# Altium schematic sheet S7CAS-PLEIADES-CARTE-MERE_P06_DAC.SchDoc
size Tabloid; SheetNumber: 17; SheetTotal: 18; Sheet_Name: DAC; Size: 11x17
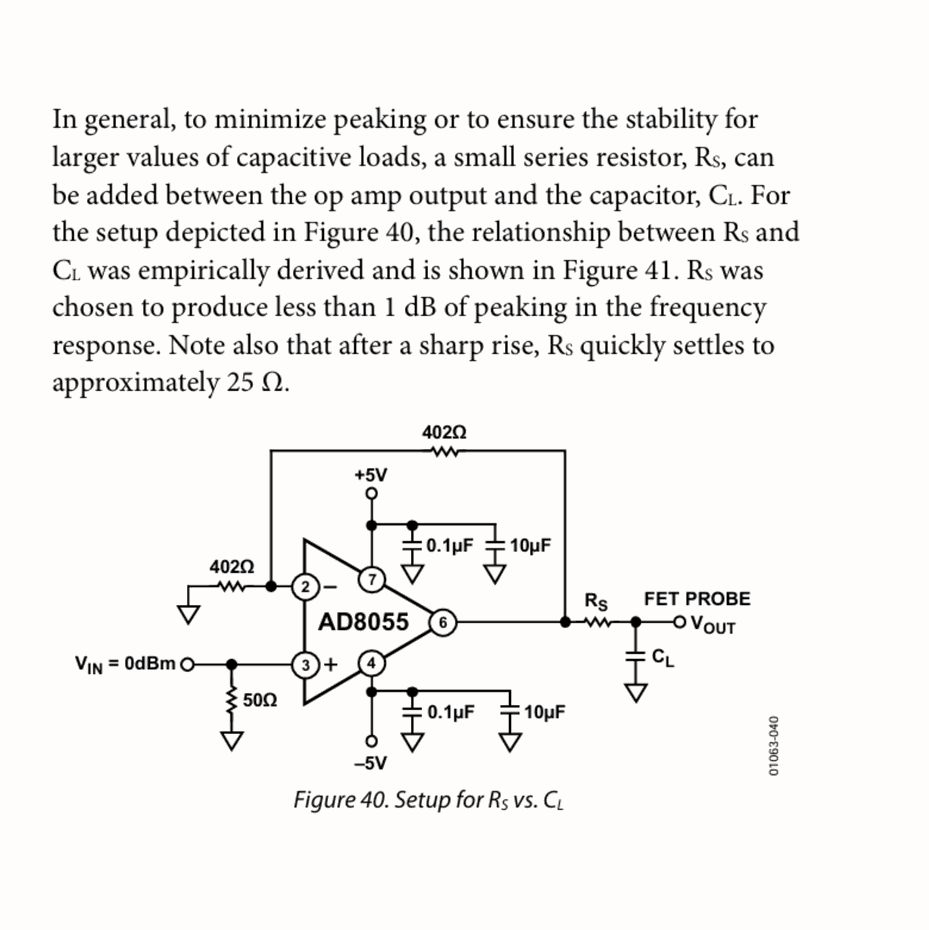
[diagram p0: S7CAS-PLEIADES-CARTE-MERE_P06_DAC.SchDoc, left]
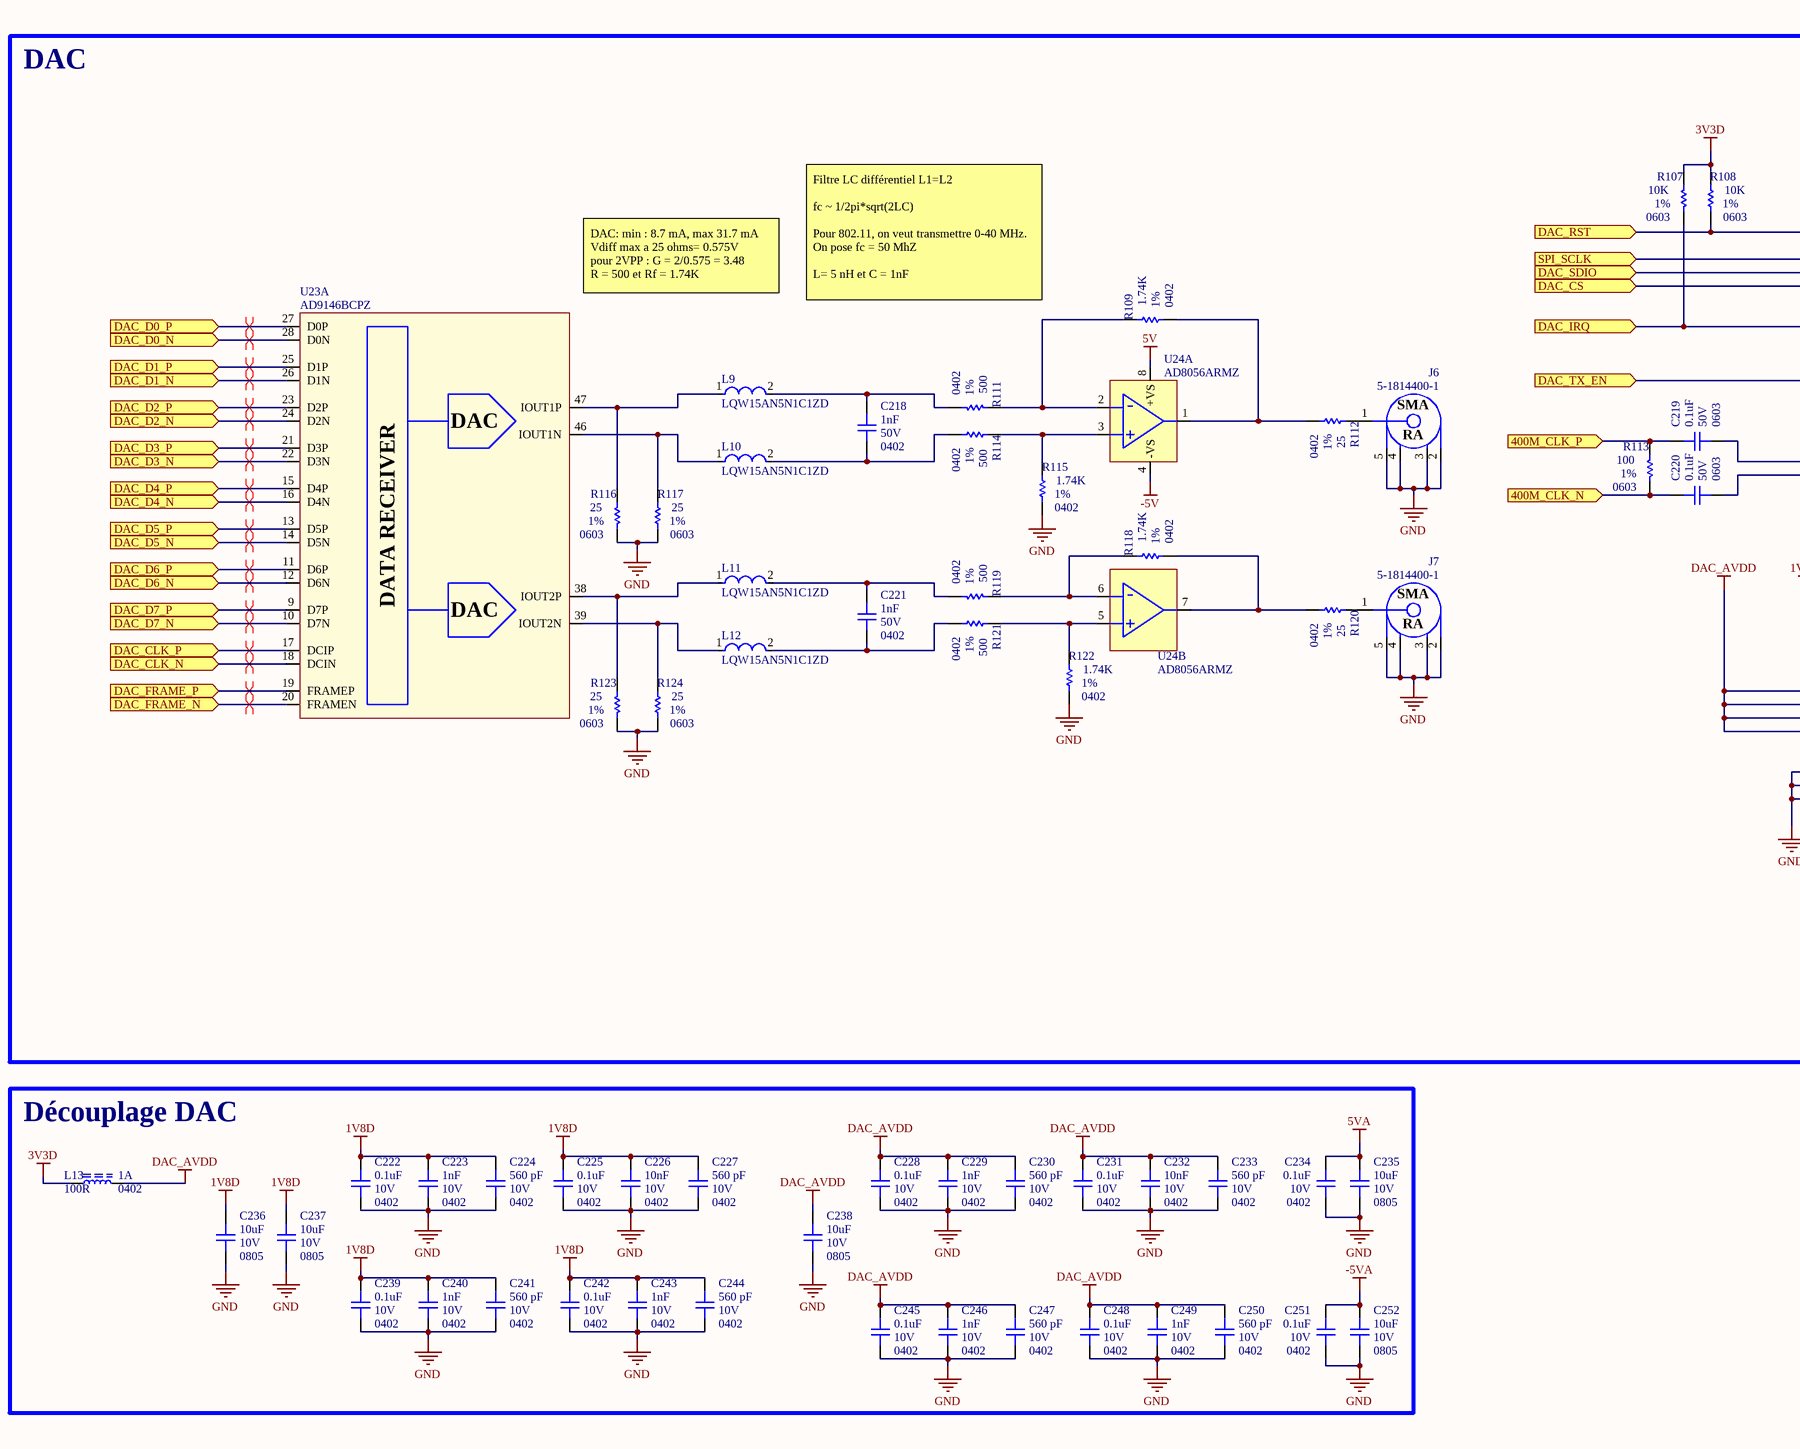
[diagram p1: S7CAS-PLEIADES-CARTE-MERE_P06_DAC.SchDoc, middle]
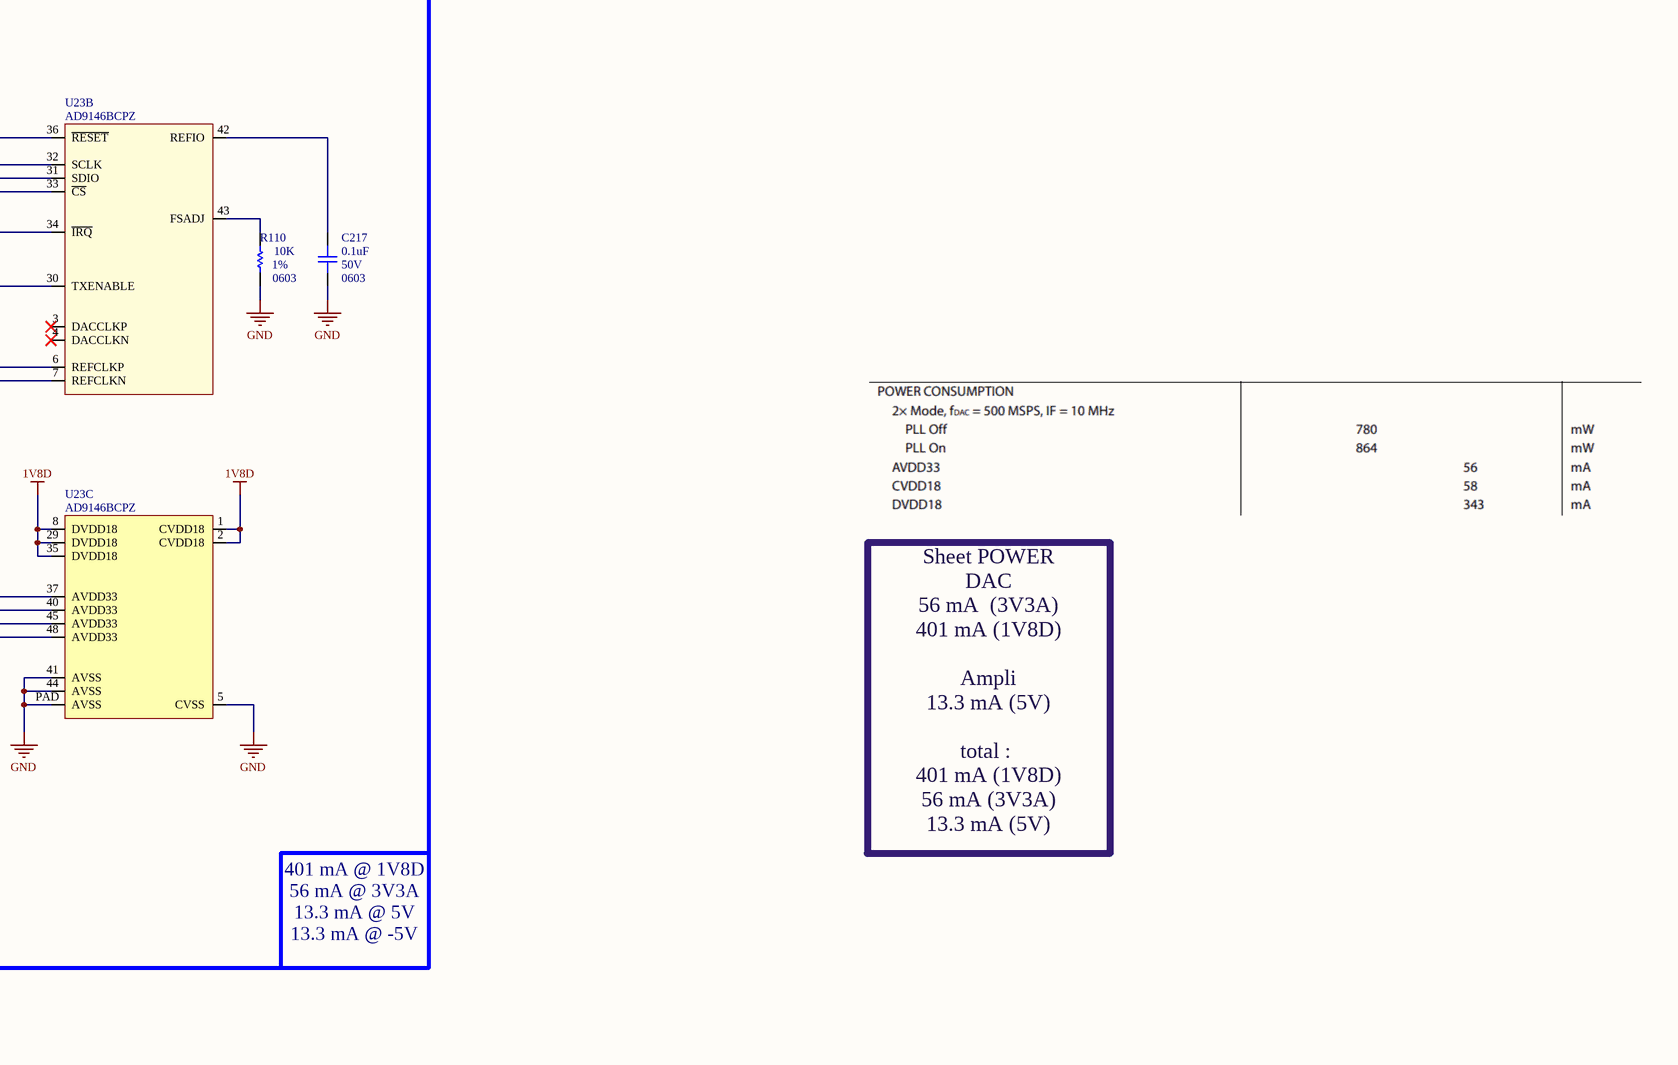
[diagram p2: S7CAS-PLEIADES-CARTE-MERE_P06_DAC.SchDoc, right]

## Parts
C217  value 0.1uF  Voltage: 50V  Package: 0603  [CAP_0603]  (hidden comment: CAP - 0603)
C218  value 1nF  Voltage: 50V  Package: 0402  [CAP_0402]  (hidden comment: CAP - 0402)
C219  value 0.1uF  Voltage: 50V  Package: 0603  [CAP_0603]  (hidden comment: CAP - 0603)
C220  value 0.1uF  Voltage: 50V  Package: 0603  [CAP_0603]  (hidden comment: CAP - 0603)
C221  value 1nF  Voltage: 50V  Package: 0402  [CAP_0402]  (hidden comment: CAP - 0402)
C222  value 0.1uF  Voltage: 10V  Package: 0402  [CAP_0402]  (hidden comment: CAP - 0402)
C223  value 1nF  Voltage: 10V  Package: 0402  [CAP_0402]  (hidden comment: CAP - 0402)
C224  value 560 pF  Voltage: 10V  Package: 0402  [CAP_0402]  (hidden comment: CAP - 0402)
C225  value 0.1uF  Voltage: 10V  Package: 0402  [CAP_0402]  (hidden comment: CAP - 0402)
C226  value 10nF  Voltage: 10V  Package: 0402  [CAP_0402]  (hidden comment: CAP - 0402)
C227  value 560 pF  Voltage: 10V  Package: 0402  [CAP_0402]  (hidden comment: CAP - 0402)
C228  value 0.1uF  Voltage: 10V  Package: 0402  [CAP_0402]  (hidden comment: CAP - 0402)
C229  value 1nF  Voltage: 10V  Package: 0402  [CAP_0402]  (hidden comment: CAP - 0402)
C230  value 560 pF  Voltage: 10V  Package: 0402  [CAP_0402]  (hidden comment: CAP - 0402)
C231  value 0.1uF  Voltage: 10V  Package: 0402  [CAP_0402]  (hidden comment: CAP - 0402)
C232  value 10nF  Voltage: 10V  Package: 0402  [CAP_0402]  (hidden comment: CAP - 0402)
C233  value 560 pF  Voltage: 10V  Package: 0402  [CAP_0402]  (hidden comment: CAP - 0402)
C234  value 0.1uF  Voltage: 10V  Package: 0402  [CAP_0402]  (hidden comment: CAP - 0402)
C235  value 10uF  Voltage: 10V  Package: 0805  [CAP_0805]  (hidden comment: CAP - 0805)
C236  value 10uF  Voltage: 10V  Package: 0805  [CAP_0805]  (hidden comment: CAP - 0805)
C237  value 10uF  Voltage: 10V  Package: 0805  [CAP_0805]  (hidden comment: CAP - 0805)
C238  value 10uF  Voltage: 10V  Package: 0805  [CAP_0805]  (hidden comment: CAP - 0805)
C239  value 0.1uF  Voltage: 10V  Package: 0402  [CAP_0402]  (hidden comment: CAP - 0402)
C240  value 1nF  Voltage: 10V  Package: 0402  [CAP_0402]  (hidden comment: CAP - 0402)
C241  value 560 pF  Voltage: 10V  Package: 0402  [CAP_0402]  (hidden comment: CAP - 0402)
C242  value 0.1uF  Voltage: 10V  Package: 0402  [CAP_0402]  (hidden comment: CAP - 0402)
C243  value 1nF  Voltage: 10V  Package: 0402  [CAP_0402]  (hidden comment: CAP - 0402)
C244  value 560 pF  Voltage: 10V  Package: 0402  [CAP_0402]  (hidden comment: CAP - 0402)
C245  value 0.1uF  Voltage: 10V  Package: 0402  [CAP_0402]  (hidden comment: CAP - 0402)
C246  value 1nF  Voltage: 10V  Package: 0402  [CAP_0402]  (hidden comment: CAP - 0402)
C247  value 560 pF  Voltage: 10V  Package: 0402  [CAP_0402]  (hidden comment: CAP - 0402)
C248  value 0.1uF  Voltage: 10V  Package: 0402  [CAP_0402]  (hidden comment: CAP - 0402)
C249  value 1nF  Voltage: 10V  Package: 0402  [CAP_0402]  (hidden comment: CAP - 0402)
C250  value 560 pF  Voltage: 10V  Package: 0402  [CAP_0402]  (hidden comment: CAP - 0402)
C251  value 0.1uF  Voltage: 10V  Package: 0402  [CAP_0402]  (hidden comment: CAP - 0402)
C252  value 10uF  Voltage: 10V  Package: 0805  [CAP_0805]  (hidden comment: CAP - 0805)
J6  5-1814400-1  [CONN_SMA_5-1814400-1]
J7  5-1814400-1  [CONN_SMA_5-1814400-1]
L9  LQW15AN5N1C1ZD  [FP-LQW15AN_00-W0_6-0_1-MFG]
L10  LQW15AN5N1C1ZD  [FP-LQW15AN_00-W0_6-0_1-MFG]
L11  LQW15AN5N1C1ZD  [FP-LQW15AN_00-W0_6-0_1-MFG]
L12  LQW15AN5N1C1ZD  [FP-LQW15AN_00-W0_6-0_1-MFG]
L13  value 100R  Current: 1A  Package: 0402  [FER_0402]  (hidden comment: FER - 0402)
R107  value 10K  Package: 0603  Precision: 1%  [RES_0603]  (hidden comment: RES - 0603)
R108  value 10K  Package: 0603  Precision: 1%  [RES_0603]  (hidden comment: RES - 0603)
R109  value 1.74K  Package: 0402  Precision: 1%  [RES_0402]  (hidden comment: RES - 0402)
R110  value 10K  Package: 0603  Precision: 1%  [RES_0603]  (hidden comment: RES - 0603)
R111  value 500  Package: 0402  Precision: 1%  [RES_0402]  (hidden comment: RES - 0402)
R112  value 25  Package: 0402  Precision: 1%  [RES_0402]  (hidden comment: RES - 0402)
R113  value 100  Package: 0603  Precision: 1%  [RES_0603]  (hidden comment: RES - 0603)
R114  value 500  Package: 0402  Precision: 1%  [RES_0402]  (hidden comment: RES - 0402)
R115  value 1.74K  Package: 0402  Precision: 1%  [RES_0402]  (hidden comment: RES - 0402)
R116  value 25  Package: 0603  Precision: 1%  [RES_0603]  (hidden comment: RES - 0603)
R117  value 25  Package: 0603  Precision: 1%  [RES_0603]  (hidden comment: RES - 0603)
R118  value 1.74K  Package: 0402  Precision: 1%  [RES_0402]  (hidden comment: RES - 0402)
R119  value 500  Package: 0402  Precision: 1%  [RES_0402]  (hidden comment: RES - 0402)
R120  value 25  Package: 0402  Precision: 1%  [RES_0402]  (hidden comment: RES - 0402)
R121  value 500  Package: 0402  Precision: 1%  [RES_0402]  (hidden comment: RES - 0402)
R122  value 1.74K  Package: 0402  Precision: 1%  [RES_0402]  (hidden comment: RES - 0402)
R123  value 25  Package: 0603  Precision: 1%  [RES_0603]  (hidden comment: RES - 0603)
R124  value 25  Package: 0603  Precision: 1%  [RES_0603]  (hidden comment: RES - 0603)
U23  AD9146BCPZ  [DAC_AD9146BCPZ]  (parts A,B,C of 3)
U24  AD8056ARMZ  [OPAMP_AD8056ARMZ]  (parts A,B of 2)

## Blocks framed on the sheet
DAC: C217-C221 J6 J7 L9-L12 R107-R124 U23 U24
Découplage DAC: C222-C252 L13

## Ports
400M_CLK_N (in, see S7CAS-PLEIADES-CARTE-MERE_P06_CLOCK[4B]), 400M_CLK_P (in, see S7CAS-PLEIADES-CARTE-MERE_P06_CLOCK[4A]), DAC_CLK_N (in, see S7CAS-PLEIADES-CARTE-MERE_P06_FPGA1[4B]), DAC_CLK_P (in, see S7CAS-PLEIADES-CARTE-MERE_P06_FPGA1[4B]), DAC_CS (in, see S7CAS-PLEIADES-CARTE-MERE_P06_FPGA3[6B]), DAC_D0_N (in, see S7CAS-PLEIADES-CARTE-MERE_P06_FPGA1[4A]), DAC_D0_P (in, see S7CAS-PLEIADES-CARTE-MERE_P06_FPGA1[4A]), DAC_D1_N (in, see S7CAS-PLEIADES-CARTE-MERE_P06_FPGA1[4A]), DAC_D1_P (in, see S7CAS-PLEIADES-CARTE-MERE_P06_FPGA1[4A]), DAC_D2_N (in, see S7CAS-PLEIADES-CARTE-MERE_P06_FPGA1[4A]), DAC_D2_P (in, see S7CAS-PLEIADES-CARTE-MERE_P06_FPGA1[4A]), DAC_D3_N (in, see S7CAS-PLEIADES-CARTE-MERE_P06_FPGA1[4A]), DAC_D3_P (in, see S7CAS-PLEIADES-CARTE-MERE_P06_FPGA1[4A]), DAC_D4_N (in, see S7CAS-PLEIADES-CARTE-MERE_P06_FPGA1[4A]), DAC_D4_P (in, see S7CAS-PLEIADES-CARTE-MERE_P06_FPGA1[4A]), DAC_D5_N (in, see S7CAS-PLEIADES-CARTE-MERE_P06_FPGA1[4A]), DAC_D5_P (in, see S7CAS-PLEIADES-CARTE-MERE_P06_FPGA1[4A]), DAC_D6_N (in, see S7CAS-PLEIADES-CARTE-MERE_P06_FPGA1[4B]), DAC_D6_P (in, see S7CAS-PLEIADES-CARTE-MERE_P06_FPGA1[4B]), DAC_D7_N (in, see S7CAS-PLEIADES-CARTE-MERE_P06_FPGA1[4B]), DAC_D7_P (in, see S7CAS-PLEIADES-CARTE-MERE_P06_FPGA1[4B]), DAC_FRAME_N (in, see S7CAS-PLEIADES-CARTE-MERE_P06_FPGA1[4B]), DAC_FRAME_P (in, see S7CAS-PLEIADES-CARTE-MERE_P06_FPGA1[4B]), DAC_IRQ (in, see S7CAS-PLEIADES-CARTE-MERE_P06_FPGA3[6B]), DAC_RST (in, see S7CAS-PLEIADES-CARTE-MERE_P06_FPGA3[6A]), DAC_SDIO (in, see S7CAS-PLEIADES-CARTE-MERE_P06_FPGA3[6B]), DAC_TX_EN (in, see S7CAS-PLEIADES-CARTE-MERE_P06_FPGA3[6B]), SPI_SCLK (in, see S7CAS-PLEIADES-CARTE-MERE_P06_FPGA3[6B])

## Nets
1V8D: C222.2 C223.2 C224.2 C225.2 C226.2 C227.2 C236.2 C237.2 C239.2 C240.2 C241.2 C242.2 C243.2 C244.2 U23.1(CVDD18) U23.2(CVDD18) U23.8(DVDD18) U23.29(DVDD18) U23.35(DVDD18)
3V3D: L13.2 R107.2 R108.2
5V: U24.8(+VS)
5VA: C234.2 C235.2
-5V: U24.4(-VS)
-5VA: C251.2 C252.2
DAC_AVDD: C228.2 C229.2 C230.2 C231.2 C232.2 C233.2 C238.2 C245.2 C246.2 C247.2 C248.2 C249.2 C250.2 L13.1 U23.37(AVDD33) U23.40(AVDD33) U23.45(AVDD33) U23.48(AVDD33)
GND: C217.1 C222.1 C223.1 C224.1 C225.1 C226.1 C227.1 C228.1 C229.1 C230.1 C231.1 C232.1 C233.1 C234.1 C235.1 C236.1 C237.1 C238.1 C239.1 C240.1 C241.1 C242.1 C243.1 C244.1 C245.1 C246.1 C247.1 C248.1 C249.1 C250.1 C251.1 C252.1 J6.2 J6.3 J6.4 J6.5 J7.2 J7.3 J7.4 J7.5 R110.1 R115.1 R116.1 R117.1 R122.1 R123.1 R124.1 U23.5(CVSS) U23.41(AVSS) U23.44(AVSS) U23.PAD(AVSS)
400M_CLK_N: C220.2 R113.1 ; port 400M_CLK_N
400M_CLK_P: C219.2 R113.2 ; port 400M_CLK_P
DAC_CLK_N: U23.18(DCIN) ; port DAC_CLK_N
DAC_CLK_P: U23.17(DCIP) ; port DAC_CLK_P
DAC_CS: U23.33(~{CS}) ; port DAC_CS
DAC_D0_N: U23.28(D0N) ; port DAC_D0_N
DAC_D0_P: U23.27(D0P) ; port DAC_D0_P
DAC_D1_N: U23.26(D1N) ; port DAC_D1_N
DAC_D1_P: U23.25(D1P) ; port DAC_D1_P
DAC_D2_N: U23.24(D2N) ; port DAC_D2_N
DAC_D2_P: U23.23(D2P) ; port DAC_D2_P
DAC_D3_N: U23.22(D3N) ; port DAC_D3_N
DAC_D3_P: U23.21(D3P) ; port DAC_D3_P
DAC_D4_N: U23.16(D4N) ; port DAC_D4_N
DAC_D4_P: U23.15(D4P) ; port DAC_D4_P
DAC_D5_N: U23.14(D5N) ; port DAC_D5_N
DAC_D5_P: U23.13(D5P) ; port DAC_D5_P
DAC_D6_N: U23.12(D6N) ; port DAC_D6_N
DAC_D6_P: U23.11(D6P) ; port DAC_D6_P
DAC_D7_N: U23.10(D7N) ; port DAC_D7_N
DAC_D7_P: U23.9(D7P) ; port DAC_D7_P
DAC_FRAME_N: U23.20(FRAMEN) ; port DAC_FRAME_N
DAC_FRAME_P: U23.19(FRAMEP) ; port DAC_FRAME_P
DAC_IRQ: R107.1 U23.34(~{IRQ}) ; port DAC_IRQ
DAC_RST: R108.1 U23.36(~{RESET}) ; port DAC_RST
DAC_SDIO: U23.31(SDIO) ; port DAC_SDIO
DAC_TX_EN: U23.30(TXENABLE) ; port DAC_TX_EN
SPI_SCLK: U23.32(SCLK) ; port SPI_SCLK
NetC217_2: C217.2 U23.42(REFIO)
NetC218_1: C218.1 L10.2 R114.1
NetC218_2: C218.2 L9.2 R111.1
NetC219_1: C219.1 U23.6(REFCLKP)
NetC220_1: C220.1 U23.7(REFCLKN)
NetC221_1: C221.1 L12.2 R121.1
NetC221_2: C221.2 L11.2 R119.1
NetJ6_1: J6.1 R112.2
NetJ7_1: J7.1 R120.2
NetL9_1: L9.1 R116.2 U23.47(IOUT1P)
NetL10_1: L10.1 R117.2 U23.46(IOUT1N)
NetL11_1: L11.1 R123.2 U23.38(IOUT2P)
NetL12_1: L12.1 R124.2 U23.39(IOUT2N)
NetR109_1: R109.1 R112.1 U24.1(OUT1)
NetR109_2: R109.2 R111.2 U24.2(-IN1)
NetR110_2: R110.2 U23.43(FSADJ)
NetR114_2: R114.2 R115.2 U24.3(+IN1)
NetR118_1: R118.1 R120.1 U24.7(OUT2)
NetR118_2: R118.2 R119.2 U24.6(-IN2)
NetR121_2: R121.2 R122.2 U24.5(+IN2)

Not connected (* = marked no-connect by the designer): U23 3(DACCLKP)* 4(DACCLKN)*

## Layout directives
differential pair: DAC_CLK_N, DAC_CLK_P, DAC_D0_N, DAC_D0_P, DAC_D1_N, DAC_D1_P, DAC_D2_N, DAC_D2_P, DAC_D3_N, DAC_D3_P, DAC_D4_N, DAC_D4_P, DAC_D5_N, DAC_D5_P, DAC_D6_N, DAC_D6_P, DAC_D7_N, DAC_D7_P, DAC_FRAME_N, DAC_FRAME_P

## Notes on the sheet
- (near U23) DAC: min : 8.7 mA, max 31.7 mA
  Vdiff max a 25 ohms= 0.575V
  pour 2VPP : G = 2/0.575 = 3.48
  R = 500 et Rf = 1.74K
- Filtre LC différentiel L1=L2
  fc ~ 1/2pi*sqrt(2LC)
  Pour 802.11, on veut transmettre 0-40 MHz. On pose fc = 50 MhZ
  L= 5 nH et C = 1nF
- Sheet POWER
  DAC
  56 mA  (3V3A)
  401 mA (1V8D)
  Ampli
  13.3 mA (5V)
  total :
  401 mA (1V8D)
  56 mA (3V3A)
  13.3 mA (5V)
- 401 mA @ 1V8D
  56 mA @ 3V3A
  13.3 mA @ 5V
  13.3 mA @ -5V
- Sheet Name
- Project Title
- Global Project
- Size
- Group
- Revision
- Date
- Sheet
- of
- Filename
- Designers
- (in symbol CONN_SMA_5-1814400-1) SMA; RA
- (in symbol DAC_AD9146BCPZ, part A) DAC; DATA RECEIVER

## Library data of the parts
C217 C219 C220 = CAP - 0603: Precision: 10%; Current: *; CreatedBy: Jonathan Bouchard; Power: *
C218 C221 = CAP - 0402: Mfg Part Number: GCM1555C1H102FA16D; Precision: 1%; Current: *; CreatedBy: Jonathan Bouchard; Power: *
C222-C234 C239-C251 = CAP - 0402: Precision: 10%; Current: *; CreatedBy: Jonathan Bouchard; Power: *
C235-C238 C252 = CAP - 0805: Precision: 10%; Current: *; CreatedBy: Jonathan Bouchard; Power: *
J6 J7 = CONN_SMA_5-1814400-1: CONN -  SMA JACK R/A 50 OHM - TH; Mfg: TE Connectivity AMP Connectors; Voltage: *; Current: *; Power: *; Mfg Part Number: 5-1814400-1; HelpURL: http://www.te.com/commerce/DocumentDelivery/DDEController?Action=srchrtrv&DocNm=1814400&DocType=Customer+Drawing&DocLang=English; CreatedBy: Jonathan Bouchard; Temperature: -55°C ~ 85°C; Value: *; Precision: *; Package: TH-5; Supplier 1: Digikey; Supplier Part Number 1: A97593-ND
L9-L12 = CMP-06042-006317-1: Wire Wound RF Inductor for Automotive 5.1nH ±0.2nH 800mA 0.051Ω 0402 (1005)
R109 R111 R112 R114 R115 R118-R122 = RES - 0402: Voltage: 50V; Power: 1/16W; Current: *; CreatedBy: Jonathan Bouchard
U23 = DAC_AD9146BCPZ: DAC - 16BIT SRL HIGH SPEED - QFN-48; Voltage: 3.13 V ~ 3.47 V / 1.71 V ~ 1.89 V; Mfg: Analog Devices Inc.; Current: *; Power: *; Mfg Part Number: AD9146BCPZ; HelpURL: http://www.analog.com/media/en/technical-documentation/data-sheets/AD9146.PDF; CreatedBy: Jonathan Bouchard; Temperature: -40°C ~ 85°C; Value: *; Precision: 16 Bit; Package: QFN-48; Supplier 1: Digikey; Supplier Part Number 1: AD9146BCPZ-ND
U24 = OPAMP_AD8056ARMZ: OPAMP - VFB 300MHZ - 8MSOP; Voltage: 8 V ~ 12 V, ±4 V ~ 6 V; Current: 60mA; Mfg: Analog Devices; Power: *; Mfg Part Number: AD8056ARMZ; HelpURL: http://www.analog.com/media/en/technical-documentation/data-sheets/AD8055_8056.pdf; CreatedBy: Jonathan Bouchard; Temperature: -40°C ~ 125°C; Value: *; Precision: *; Package: MSOP-8; Supplier 1: Digikey; Supplier Part Number 1: AD8056ARMZ-REEL7CT-ND
L13 = FER - 0402: Voltage: *; CreatedBy: Jonathan Bouchard; Power: *; Precision: *
R107 R108 R110 R113 R116 R117 R123 R124 = RES - 0603: Current: *; CreatedBy: Jonathan Bouchard